# EasyEDA schematic SSC_SCH.json
TITLE: Sheet_1; REV: 1.0; Date: 2020-03-02; Sheet: 1/1; Drawn By: moreiralucascde; Company: Your Company
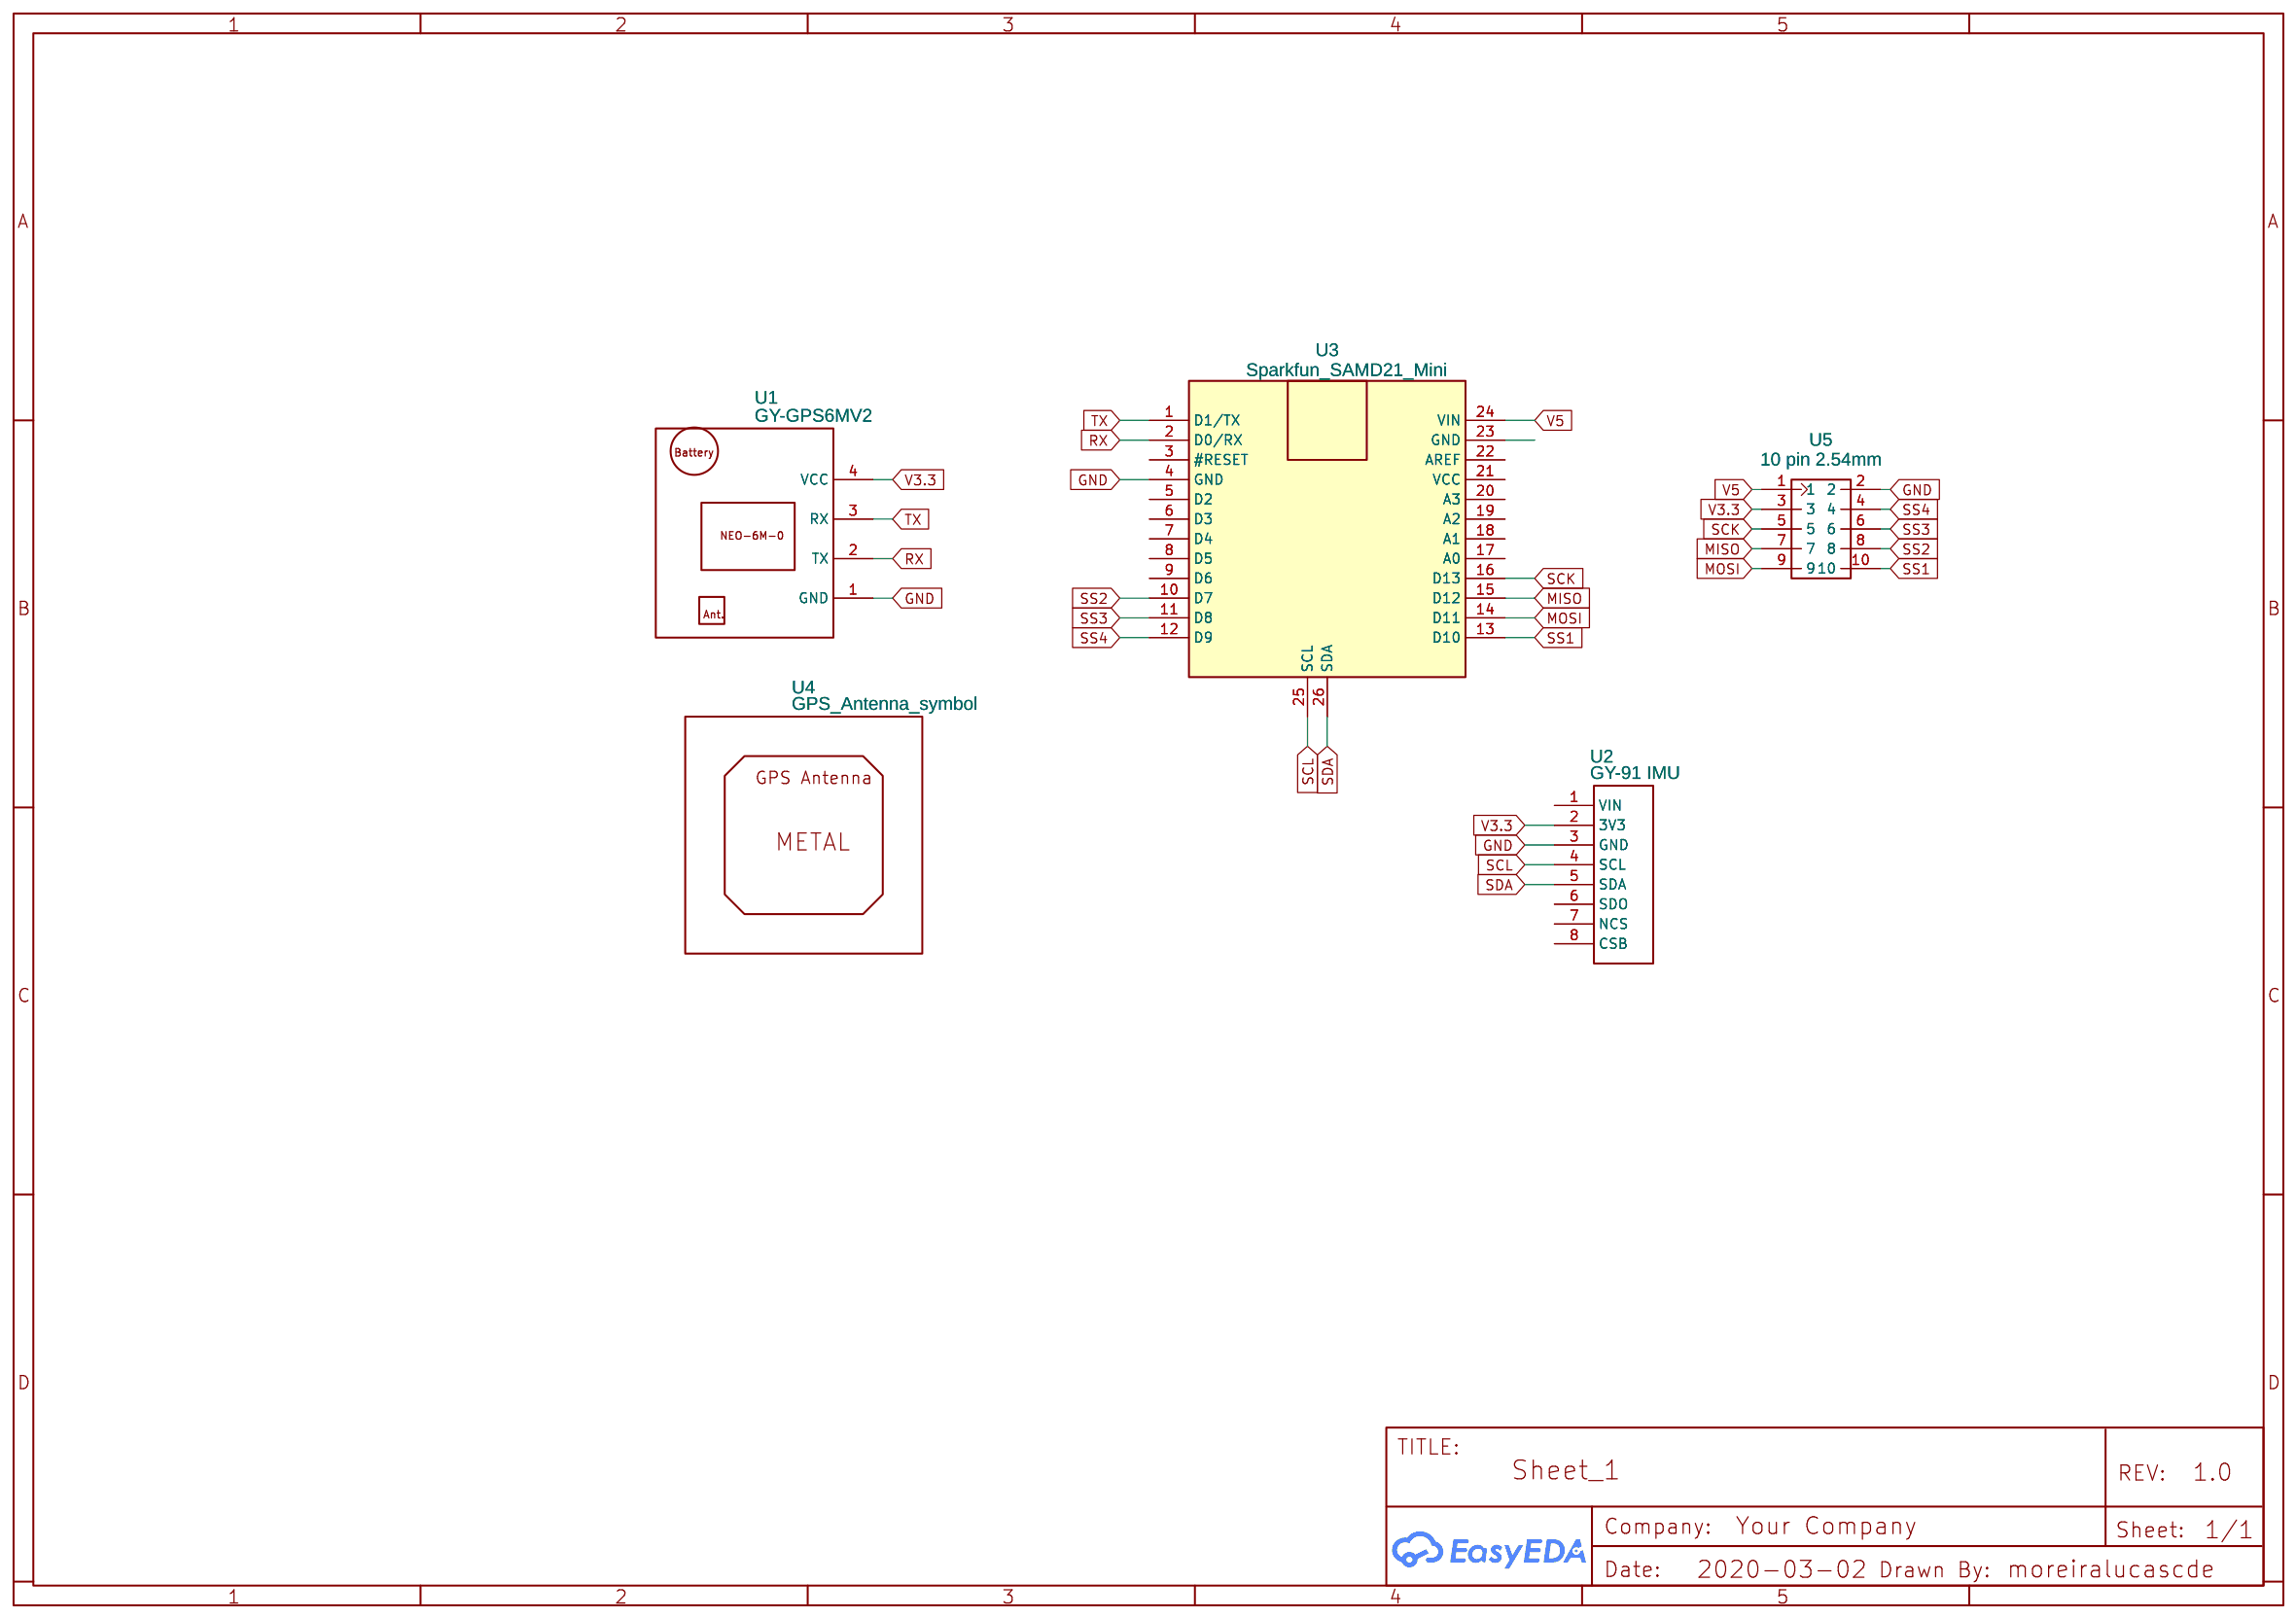
[diagram p0: schematic sheet]

## Parts
U1  GY-GPS6MV2  [GY-GPS6MV2]
U2  GY-91 IMU  [GY-91 MPU9250 BMP280]
U3  Sparkfun_SAMD21_Mini  [SPARKFUN_SAMD21MINI]
U4  GPS_Antenna_symbol  [GPS CERAMIC ANTENNA 28X28MM]
U5  10 pin 2.54mm  [10 PIN 2.54MM LUCAS]

## Library data of the parts
U1 = GY-GPS6MV2: Contributor: rjshiffer
U2 = GY-91: Contributor: gtf.crimea
U3 = Sparkfun_SAMD21_Mini: Manufacturer Part: New SchematicLib; Contributor: gjt211; Supplier: Sparkfun
U4 = GPS_Antenna_symbol: catid: 20; Contributor: MateuszManaj
U5 = 10 pin 2.54mm: Manufacturer: Amphenol ICC (FCI); Manufacturer Part: 67997-410HLF; Supplier: Digi-Key; Supplier Part: 609-3243-ND; link: https://www.digikey.com/product-detail/en/67997-410HLF/609-3243-ND/1878475/?itemSeq=298559326; Contributor: Yugi

## Nets
GND: U1.1(GND) U2.3(GND) U3.4(GND) U5.2
V3.3: U1.4(VCC) U2.2(3V3) U5.3
V5: U3.24(VIN) U5.1
MISO: U3.15(D12) U5.7
MOSI: U3.14(D11) U5.9
RX: U1.2(TX) U3.2(D0/RX)
SCK: U3.16(D13) U5.5
SCL: U2.4(SCL) U3.25(SCL)
SDA: U2.5(SDA) U3.26(SDA)
SS1: U3.13(D10) U5.10
SS2: U3.10(D7) U5.8
SS3: U3.11(D8) U5.6
SS4: U3.12(D9) U5.4
TX: U1.3(RX) U3.1(D1/TX)

Not connected (* = marked no-connect by the designer): U2 1(VIN) 6(SDO) 7(NCS) 8(CSB); U3 3(#RESET) 5(D2) 6(D3) 7(D4) 8(D5) 9(D6) 17(A0) 18(A1) 19(A2) 20(A3) 21(VCC) 22(AREF) 23(GND)
